# EAGLE schematic ES_Daisy_Patch_Rev4 (EAGLE 9.6.2)

## Sheet 1 of 4
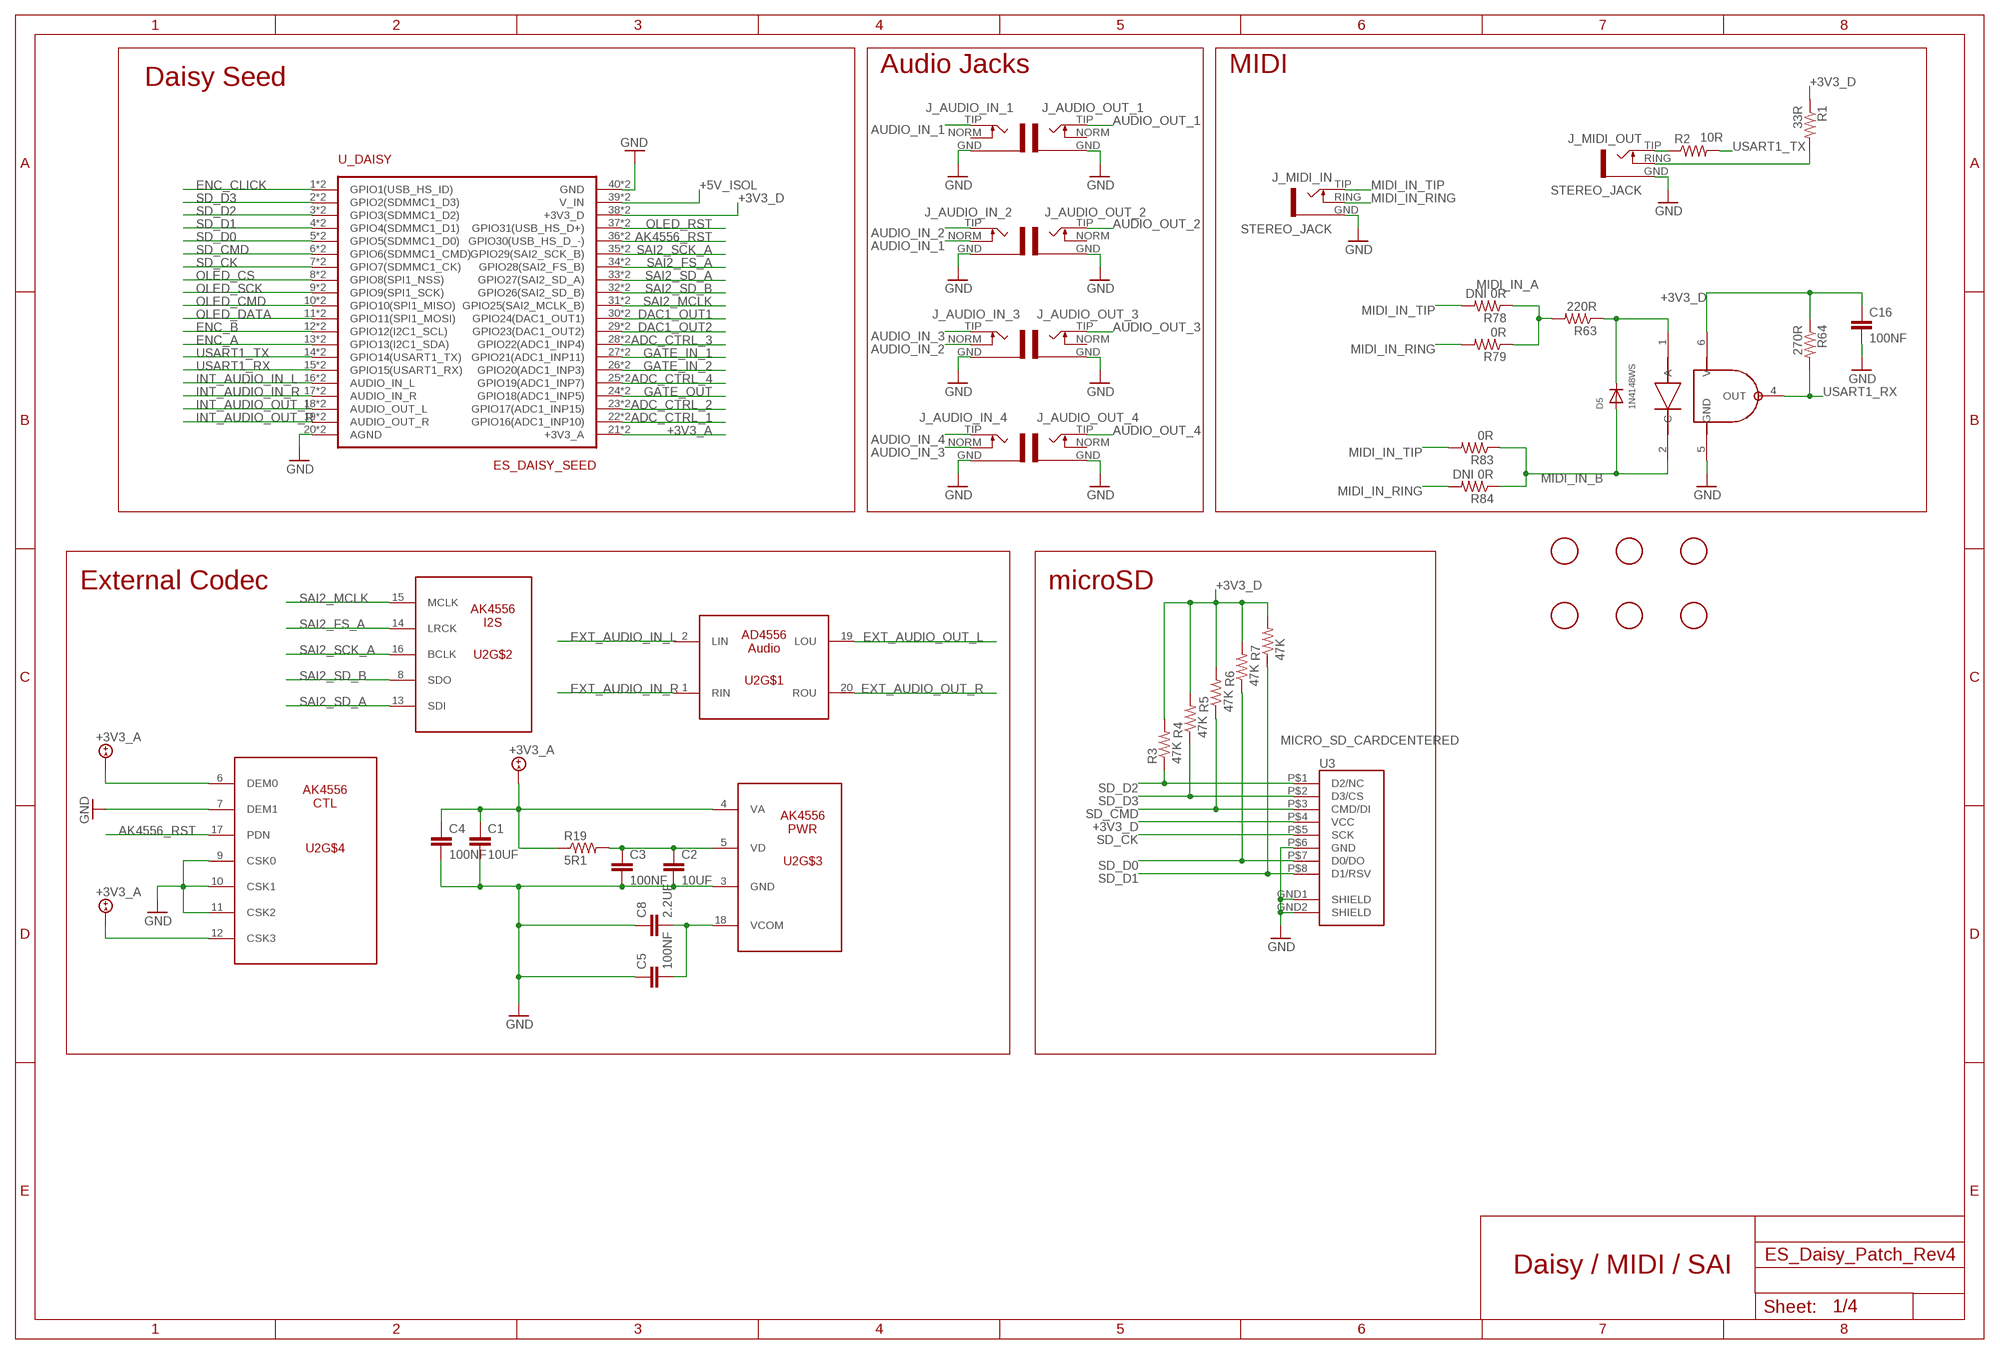
[diagram p0: schematic, sheet 1]

### Parts
C1  10UF  C-EUC0805  [C0805]
C2  10UF  C-EUC0805  [C0805]
C3  100NF  C-EUC0603  [C0603]
C4  100NF  C-EUC0603  [C0603]
C5  100NF  C-EUC0603  [C0603]
C8  2.2UF  C-EUC0603  [C0603]
C16  100NF  C-EUC0603  [C0603]
D5  1N4148WS  DIODE_SOD-323F  [SOD-323F]
FD1  FIDUCIAL  [FIDUCIAL_1MM]
FD2  FIDUCIAL  [FIDUCIAL_1MM]
FD3  FIDUCIAL  [FIDUCIAL_1MM]
FD4  FIDUCIAL  [FIDUCIAL_1MM]
FD5  FIDUCIAL  [FIDUCIAL_1MM]
FD6  FIDUCIAL  [FIDUCIAL_1MM]
J_AUDIO_IN_1  EURO_JACK  [S_JACK]
J_AUDIO_IN_2  EURO_JACK  [S_JACK]
J_AUDIO_IN_3  EURO_JACK  [S_JACK]
J_AUDIO_IN_4  EURO_JACK  [S_JACK]
J_AUDIO_OUT_1  EURO_JACK  [S_JACK]
J_AUDIO_OUT_2  EURO_JACK  [S_JACK]
J_AUDIO_OUT_3  EURO_JACK  [S_JACK]
J_AUDIO_OUT_4  EURO_JACK  [S_JACK]
J_MIDI_IN  STEREO_JACK  [STEREO_JACK_3.5MM]
J_MIDI_OUT  STEREO_JACK  [STEREO_JACK_3.5MM]
R1  33R  R-US_R0603  [R0603]
R2  10R  R-US_R0603  [R0603]
R3  47K  R-US_R0603  [R0603]
R4  47K  R-US_R0603  [R0603]
R5  47K  R-US_R0603  [R0603]
R6  47K  R-US_R0603  [R0603]
R7  47K  R-US_R0603  [R0603]
R19  5R1  R-US_R0603  [R0603]
R63  220R  R-US_R0603  [R0603]
R64  270R  R-US_R0603  [R0603]
R78  DNI 0R  R-US_R0603  [R0603]
R79  0R  R-US_R0603  [R0603]
R83  0R  R-US_R0603  [R0603]
R84  DNI 0R  R-US_R0603  [R0603]
U2  AK4556  [TSSOP20]
U3  MICRO_SD_CARDCENTERED  [VERT_MICROSD_CENTERED]
U15  OPTOISOLATOR_H11L1M  [DIL06_GULLWING]
U_DAISY  ES_DAISY_SEED  ES_DAISY_SEED_REV4_DOUBLE  [ES_DAISY_SEED_DOUBLE]

### Nets
+3V3_A: C1.1 C4.1 R19.1 U2.4(VA) U2.6(DEM0) U2.12(CSK3) U_DAISY.21(+3V3_A) U_DAISY.B21(+3V3_A) ; also sheet 2
+3V3_D: C16.1 R1.1 R3.2 R4.2 R5.2 R6.2 R7.2 R64.1 U3.P$4(VCC) U15.6(V) U_DAISY.38(+3V3_D) U_DAISY.B38(+3V3_D) ; also sheet 2,4
+5V_ISOL: U_DAISY.39(V_IN) U_DAISY.B39(V_IN) ; also sheet 4
ADC_CTRL_1: U_DAISY.22(GPIO16(ADC1_INP10)) U_DAISY.B22(GPIO16(ADC1_INP10)) ; also sheet 2
ADC_CTRL_2: U_DAISY.23(GPIO17(ADC1_INP15)) U_DAISY.B23(GPIO17(ADC1_INP15)) ; also sheet 2
ADC_CTRL_3: U_DAISY.28(GPIO22(ADC1_INP4)) U_DAISY.B28(GPIO22(ADC1_INP4)) ; also sheet 2
ADC_CTRL_4: U_DAISY.25(GPIO19(ADC1_INP7)) U_DAISY.B25(GPIO19(ADC1_INP7)) ; also sheet 2
AK4556_RST: U2.17(PDN) U_DAISY.36(GPIO30(USB_HS_D_-)) U_DAISY.B36(GPIO30(USB_HS_D_-))
AUDIO_IN_1: J_AUDIO_IN_1.TIP J_AUDIO_IN_2.NORM ; also sheet 3
AUDIO_IN_2: J_AUDIO_IN_2.TIP J_AUDIO_IN_3.NORM ; also sheet 3
AUDIO_IN_3: J_AUDIO_IN_3.TIP J_AUDIO_IN_4.NORM ; also sheet 3
AUDIO_IN_4: J_AUDIO_IN_4.TIP ; also sheet 3
AUDIO_OUT_1: J_AUDIO_OUT_1.TIP ; also sheet 3
AUDIO_OUT_2: J_AUDIO_OUT_2.TIP ; also sheet 3
AUDIO_OUT_3: J_AUDIO_OUT_3.TIP ; also sheet 3
AUDIO_OUT_4: J_AUDIO_OUT_4.TIP ; also sheet 3
DAC1_OUT1: U_DAISY.30(GPIO24(DAC1_OUT1)) U_DAISY.B30(GPIO24(DAC1_OUT1)) ; also sheet 2
DAC1_OUT2: U_DAISY.29(GPIO23(DAC1_OUT2)) U_DAISY.B29(GPIO23(DAC1_OUT2)) ; also sheet 2
ENC_A: U_DAISY.13(GPIO13(I2C1_SDA)) U_DAISY.B13(GPIO13(I2C1_SDA)) ; also sheet 4
ENC_B: U_DAISY.12(GPIO12(I2C1_SCL)) U_DAISY.B12(GPIO12(I2C1_SCL)) ; also sheet 4
ENC_CLICK: U_DAISY.1(GPIO1(USB_HS_ID)) U_DAISY.B1(GPIO1(USB_HS_ID)) ; also sheet 4
EXT_AUDIO_IN_L: U2.2(LIN) ; also sheet 3
EXT_AUDIO_IN_R: U2.1(RIN) ; also sheet 3
EXT_AUDIO_OUT_L: U2.19(LOU) ; also sheet 3
EXT_AUDIO_OUT_R: U2.20(ROU) ; also sheet 3
GATE_IN_1: U_DAISY.27(GPIO21(ADC1_INP11)) U_DAISY.B27(GPIO21(ADC1_INP11)) ; also sheet 2
GATE_IN_2: U_DAISY.26(GPIO20(ADC1_INP3)) U_DAISY.B26(GPIO20(ADC1_INP3)) ; also sheet 2
GATE_OUT: U_DAISY.24(GPIO18(ADC1_INP5)) U_DAISY.B24(GPIO18(ADC1_INP5)) ; also sheet 2
GND: C1.2 C2.2 C3.2 C4.2 C5.1 C8.1 C16.2 J_AUDIO_IN_1.GND J_AUDIO_IN_2.GND J_AUDIO_IN_3.GND J_AUDIO_IN_4.GND J_AUDIO_OUT_1.GND J_AUDIO_OUT_2.GND J_AUDIO_OUT_3.GND J_AUDIO_OUT_4.GND J_MIDI_IN.GND J_MIDI_OUT.GND U2.3(GND) U2.7(DEM1) U2.9(CSK0) U2.10(CSK1) U2.11(CSK2) U3.GND1(SHIELD) U3.GND2(SHIELD) U3.P$6(GND) U15.5(GND) U_DAISY.20(AGND) U_DAISY.40(GND) U_DAISY.B20(AGND) U_DAISY.B40(GND) ; also sheet 2,3,4
INT_AUDIO_IN_L: U_DAISY.16(AUDIO_IN_L) U_DAISY.B16(AUDIO_IN_L) ; also sheet 3
INT_AUDIO_IN_R: U_DAISY.17(AUDIO_IN_R) U_DAISY.B17(AUDIO_IN_R) ; also sheet 3
INT_AUDIO_OUT_L: U_DAISY.18(AUDIO_OUT_L) U_DAISY.B18(AUDIO_OUT_L) ; also sheet 3
INT_AUDIO_OUT_R: U_DAISY.19(AUDIO_OUT_R) U_DAISY.B19(AUDIO_OUT_R) ; also sheet 3
MIDI_IN_A: R63.2 R78.1 R79.1
MIDI_IN_B: D5.A R83.1 R84.1 U15.2(C)
MIDI_IN_RING: J_MIDI_IN.RING(NORM) R79.2 R84.2
MIDI_IN_TIP: J_MIDI_IN.TIP R78.2 R83.2
N$7: J_MIDI_OUT.TIP R2.1
N$9: J_MIDI_OUT.RING(NORM) R1.2
N$24: C2.1 C3.1 R19.2 U2.5(VD)
N$25: C5.2 C8.2 U2.18(VCOM)
N$77: D5.C R63.1 U15.1(A)
OLED_CMD: U_DAISY.10(GPIO10(SPI1_MISO)) U_DAISY.B10(GPIO10(SPI1_MISO)) ; also sheet 4
OLED_CS: U_DAISY.8(GPIO8(SPI1_NSS)) U_DAISY.B8(GPIO8(SPI1_NSS)) ; also sheet 4
OLED_DATA: U_DAISY.11(GPIO11(SPI1_MOSI)) U_DAISY.B11(GPIO11(SPI1_MOSI)) ; also sheet 4
OLED_RST: U_DAISY.37(GPIO31(USB_HS_D+)) U_DAISY.B37(GPIO31(USB_HS_D+)) ; also sheet 4
OLED_SCK: U_DAISY.9(GPIO9(SPI1_SCK)) U_DAISY.B9(GPIO9(SPI1_SCK)) ; also sheet 4
SAI2_FS_A: U2.14(LRCK) U_DAISY.34(GPIO28(SAI2_FS_B)) U_DAISY.B34(GPIO28(SAI2_FS_B))
SAI2_MCLK: U2.15(MCLK) U_DAISY.31(GPIO25(SAI2_MCLK_B)) U_DAISY.B31(GPIO25(SAI2_MCLK_B))
SAI2_SCK_A: U2.16(BCLK) U_DAISY.35(GPIO29(SAI2_SCK_B)) U_DAISY.B35(GPIO29(SAI2_SCK_B))
SAI2_SD_A: U2.13(SDI) U_DAISY.33(GPIO27(SAI2_SD_A)) U_DAISY.B33(GPIO27(SAI2_SD_A))
SAI2_SD_B: U2.8(SDO) U_DAISY.32(GPIO26(SAI2_SD_B)) U_DAISY.B32(GPIO26(SAI2_SD_B))
SD_CK: U3.P$5(SCK) U_DAISY.7(GPIO7(SDMMC1_CK)) U_DAISY.B7(GPIO7(SDMMC1_CK))
SD_CMD: R5.1 U3.P$3(CMD/DI) U_DAISY.6(GPIO6(SDMMC1_CMD)) U_DAISY.B6(GPIO6(SDMMC1_CMD))
SD_D0: R6.1 U3.P$7(D0/DO) U_DAISY.5(GPIO5(SDMMC1_D0)) U_DAISY.B5(GPIO5(SDMMC1_D0))
SD_D1: R7.1 U3.P$8(D1/RSV) U_DAISY.4(GPIO4(SDMMC1_D1)) U_DAISY.B4(GPIO4(SDMMC1_D1))
SD_D2: R3.1 U3.P$1(D2/NC) U_DAISY.3(GPIO3(SDMMC1_D2)) U_DAISY.B3(GPIO3(SDMMC1_D2))
SD_D3: R4.1 U3.P$2(D3/CS) U_DAISY.2(GPIO2(SDMMC1_D3)) U_DAISY.B2(GPIO2(SDMMC1_D3))
USART1_RX: R64.2 U15.4(OUT) U_DAISY.15(GPIO15(USART1_RX)) U_DAISY.B15(GPIO15(USART1_RX))
USART1_TX: R2.2 U_DAISY.14(GPIO14(USART1_TX)) U_DAISY.B14(GPIO14(USART1_TX))
Unconnected: J_AUDIO_IN_1.NORM J_AUDIO_OUT_1.NORM J_AUDIO_OUT_2.NORM J_AUDIO_OUT_3.NORM J_AUDIO_OUT_4.NORM

### Notes on the sheet
- Audio Jacks | MIDI
- Daisy Seed
- External Codec | microSD
- Daisy / MIDI / SAI

## Sheet 2 of 4
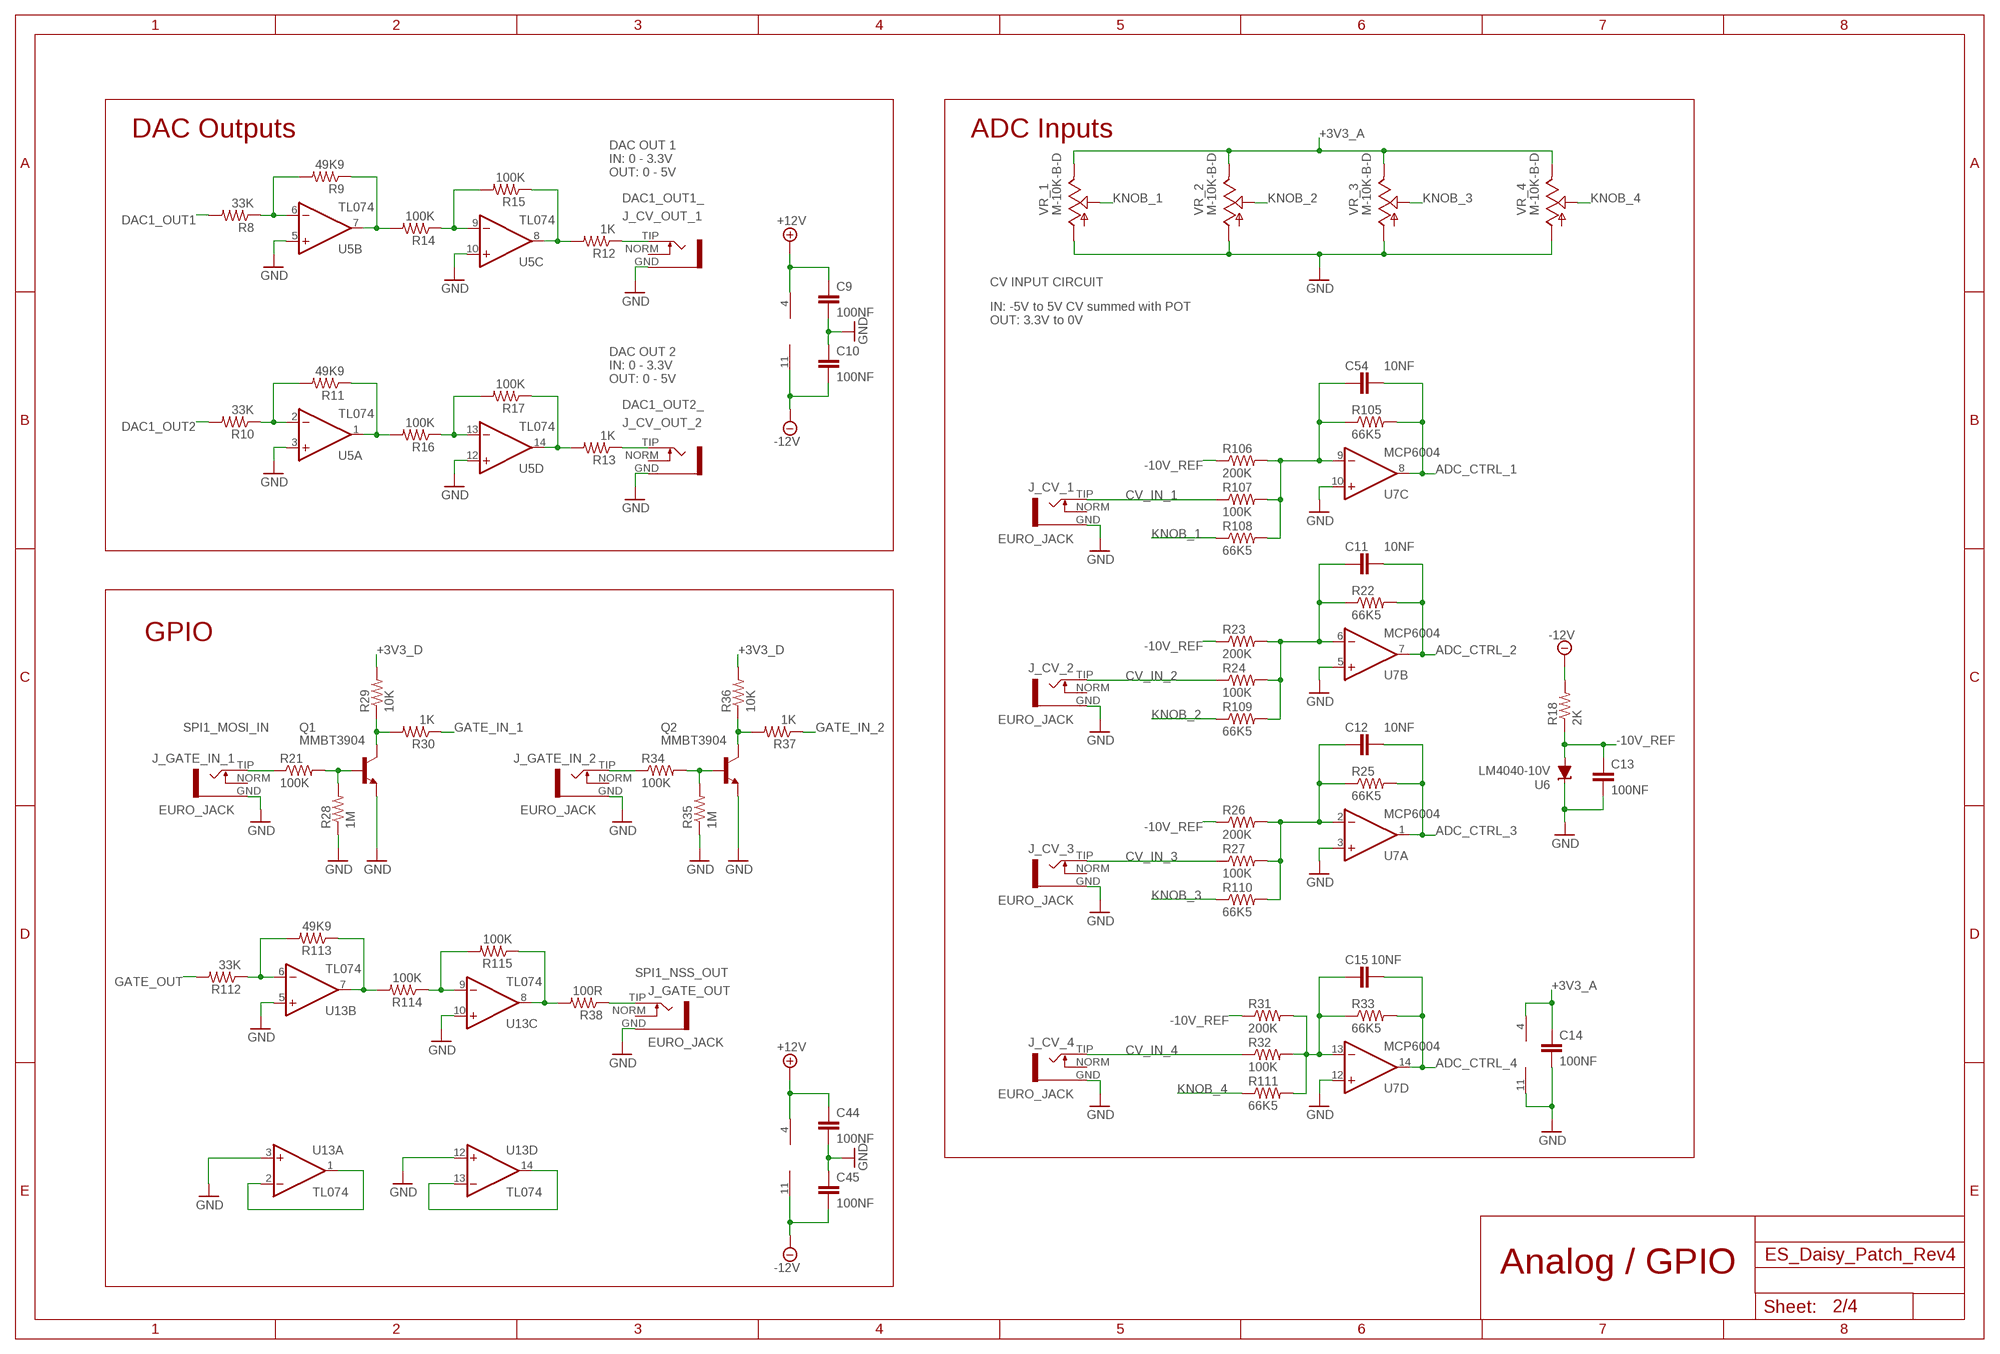
[diagram p1: schematic, sheet 2]

### Parts
C9  100NF  C-EUC0603  [C0603]
C10  100NF  C-EUC0603  [C0603]
C11  10NF  C-EUC0603  [C0603]
C12  10NF  C-EUC0603  [C0603]
C13  100NF  C-EUC0603  [C0603]
C14  100NF  C-EUC0603  [C0603]
C15  10NF  C-EUC0603  [C0603]
C44  100NF  C-EUC0603  [C0603]
C45  100NF  C-EUC0603  [C0603]
C54  10NF  C-EUC0603  [C0603]
J_CV_1  EURO_JACK  [S_JACK]
J_CV_2  EURO_JACK  [S_JACK]
J_CV_3  EURO_JACK  [S_JACK]
J_CV_4  EURO_JACK  [S_JACK]
J_CV_OUT_1  EURO_JACK  [S_JACK]
J_CV_OUT_2  EURO_JACK  [S_JACK]
J_GATE_IN_1  EURO_JACK  [S_JACK]
J_GATE_IN_2  EURO_JACK  [S_JACK]
J_GATE_OUT  EURO_JACK  [S_JACK]
Q1  MMBT3904  NPNSOT23-BEC  [SOT23-BEC]
Q2  MMBT3904  NPNSOT23-BEC  [SOT23-BEC]
R8  33K  R-US_R0603  [R0603]
R9  49K9  R-US_R0603  [R0603]
R10  33K  R-US_R0603  [R0603]
R11  49K9  R-US_R0603  [R0603]
R12  1K  R-US_R0603  [R0603]
R13  1K  R-US_R0603  [R0603]
R14  100K  R-US_R0603  [R0603]
R15  100K  R-US_R0603  [R0603]
R16  100K  R-US_R0603  [R0603]
R17  100K  R-US_R0603  [R0603]
R18  2K  R-US_R0603  [R0603]
R21  100K  R-US_R0603  [R0603]
R22  66K5  R-US_R0603  [R0603]
R23  200K  R-US_R0603  [R0603]
R24  100K  R-US_R0603  [R0603]
R25  66K5  R-US_R0603  [R0603]
R26  200K  R-US_R0603  [R0603]
R27  100K  R-US_R0603  [R0603]
R28  1M  R-US_R0603  [R0603]
R29  10K  R-US_R0603  [R0603]
R30  1K  R-US_R0603  [R0603]
R31  200K  R-US_R0603  [R0603]
R32  100K  R-US_R0603  [R0603]
R33  66K5  R-US_R0603  [R0603]
R34  100K  R-US_R0603  [R0603]
R35  1M  R-US_R0603  [R0603]
R36  10K  R-US_R0603  [R0603]
R37  1K  R-US_R0603  [R0603]
R38  100R  R-US_R0603  [R0603]
R105  66K5  R-US_R0603  [R0603]
R106  200K  R-US_R0603  [R0603]
R107  100K  R-US_R0603  [R0603]
R108  66K5  R-US_R0603  [R0603]
R109  66K5  R-US_R0603  [R0603]
R110  66K5  R-US_R0603  [R0603]
R111  66K5  R-US_R0603  [R0603]
R112  33K  R-US_R0603  [R0603]
R113  49K9  R-US_R0603  [R0603]
R114  100K  R-US_R0603  [R0603]
R115  100K  R-US_R0603  [R0603]
U5  TL074  TL074_TSSOP-14  [TSSOP-14]
U6  LM4040-10V  LM4040-10VA12DBZ  [DBZ_R-PDSO-G3]
U7  MCP6004  MCP6004_TSSOP-14  [TSSOP-14]
U13  TL074  TL074_TSSOP-14  [TSSOP-14]
VR_1  M-10K-B-D  POT_9MM_SNAP-IN__  [9MM_SNAP-IN_POT_SILK]
VR_2  M-10K-B-D  POT_9MM_SNAP-IN__  [9MM_SNAP-IN_POT_SILK]
VR_3  M-10K-B-D  POT_9MM_SNAP-IN__  [9MM_SNAP-IN_POT_SILK]
VR_4  M-10K-B-D  POT_9MM_SNAP-IN__  [9MM_SNAP-IN_POT_SILK]

### Nets
+3V3_A: C14.1 U7.4(P:V+) VR_1.3 VR_2.3 VR_3.3 VR_4.3 ; also sheet 1
+3V3_D: R29.2 R36.2 ; also sheet 1,4
+12V: C9.1 C44.1 U5.4(P:V+) U13.4(P:V+) ; also sheet 3,4
-10V_REF: C13.1 R18.1 R23.1 R26.1 R31.1 R106.1 U6.2(A)
-12V: C10.2 C45.2 R18.2 U5.11(P:V-) U13.11(P:V-) ; also sheet 3,4
ADC_CTRL_1: C54.2 R105.2 U7.8(C:OUT) ; also sheet 1
ADC_CTRL_2: C11.2 R22.2 U7.7(B:OUT) ; also sheet 1
ADC_CTRL_3: C12.2 R25.2 U7.1(A:OUT) ; also sheet 1
ADC_CTRL_4: C15.2 R33.2 U7.14(D:OUT) ; also sheet 1
CV_IN_1: J_CV_1.TIP R107.1
CV_IN_2: J_CV_2.TIP R24.1
CV_IN_3: J_CV_3.TIP R27.1
CV_IN_4: J_CV_4.TIP R32.1
DAC1_OUT1: R8.2 ; also sheet 1
DAC1_OUT1_: J_CV_OUT_1.TIP R12.1
DAC1_OUT2: R10.2 ; also sheet 1
DAC1_OUT2_: J_CV_OUT_2.TIP R13.1
GATE_IN_1: R30.1 ; also sheet 1
GATE_IN_2: R37.1 ; also sheet 1
GATE_OUT: R112.2 ; also sheet 1
GND: C9.2 C10.1 C13.2 C14.2 C44.2 C45.1 J_CV_1.GND J_CV_2.GND J_CV_3.GND J_CV_4.GND J_CV_OUT_1.GND J_CV_OUT_2.GND J_GATE_IN_1.GND J_GATE_IN_2.GND J_GATE_OUT.GND Q1.E Q2.E R28.1 R35.1 U5.3(A:+IN) U5.5(B:+IN) U5.10(C:+IN) U5.12(D:+IN) U6.1(C) U7.3(A:+IN) U7.5(B:+IN) U7.10(C:+IN) U7.11(P:V-) U7.12(D:+IN) U13.3(A:+IN) U13.5(B:+IN) U13.10(C:+IN) U13.12(D:+IN) VR_1.1 VR_2.1 VR_3.1 VR_4.1 ; also sheet 1,3,4
KNOB_1: R108.1 VR_1.2
KNOB_2: R109.1 VR_2.2
KNOB_3: R110.1 VR_3.2
KNOB_4: R111.1 VR_4.2
N$1: R14.1 R15.2 U5.9(C:-IN)
N$10: R12.2 R15.1 U5.8(C:OUT)
N$11: R8.1 R9.2 U5.6(B:-IN)
N$12: R9.1 R14.2 U5.7(B:OUT)
N$13: C54.1 R105.1 R106.2 R107.2 R108.2 U7.9(C:-IN)
N$14: R10.1 R11.2 U5.2(A:-IN)
N$15: R11.1 R16.2 U5.1(A:OUT)
N$16: R112.1 R113.2 U13.6(B:-IN)
N$17: R16.1 R17.2 U5.13(D:-IN)
N$18: R13.2 R17.1 U5.14(D:OUT)
N$19: U13.1(A:OUT) U13.2(A:-IN)
N$20: R113.1 R114.2 U13.7(B:OUT)
N$21: R114.1 R115.2 U13.9(C:-IN)
N$22: R38.2 R115.1 U13.8(C:OUT)
N$23: Q1.C R29.1 R30.2
N$27: C11.1 R22.1 R23.2 R24.2 R109.2 U7.6(B:-IN)
N$30: Q2.B R34.2 R35.2
N$31: C12.1 R25.1 R26.2 R27.2 R110.2 U7.2(A:-IN)
N$32: Q1.B R21.2 R28.2
N$33: Q2.C R36.1 R37.2
N$39: C15.1 R31.2 R32.2 R33.1 R111.2 U7.13(D:-IN)
N$59: U13.13(D:-IN) U13.14(D:OUT)
SPI1_MISO_IN: J_GATE_IN_2.TIP R34.1
SPI1_MOSI_IN: J_GATE_IN_1.TIP R21.1
SPI1_NSS_OUT: J_GATE_OUT.TIP R38.1
Unconnected: J_CV_1.NORM J_CV_2.NORM J_CV_3.NORM J_CV_4.NORM J_CV_OUT_1.NORM J_CV_OUT_2.NORM J_GATE_IN_1.NORM J_GATE_IN_2.NORM J_GATE_OUT.NORM

### Notes on the sheet
- DAC Outputs | ADC Inputs
- DAC OUT 1
  IN: 0 - 3.3V
  OUT: 0 - 5V
- CV INPUT CIRCUIT
- IN: -5V to 5V CV summed with POT
  OUT: 3.3V to 0V
- DAC OUT 2
  IN: 0 - 3.3V
  OUT: 0 - 5V
- GPIO
- Analog / GPIO

## Sheet 3 of 4
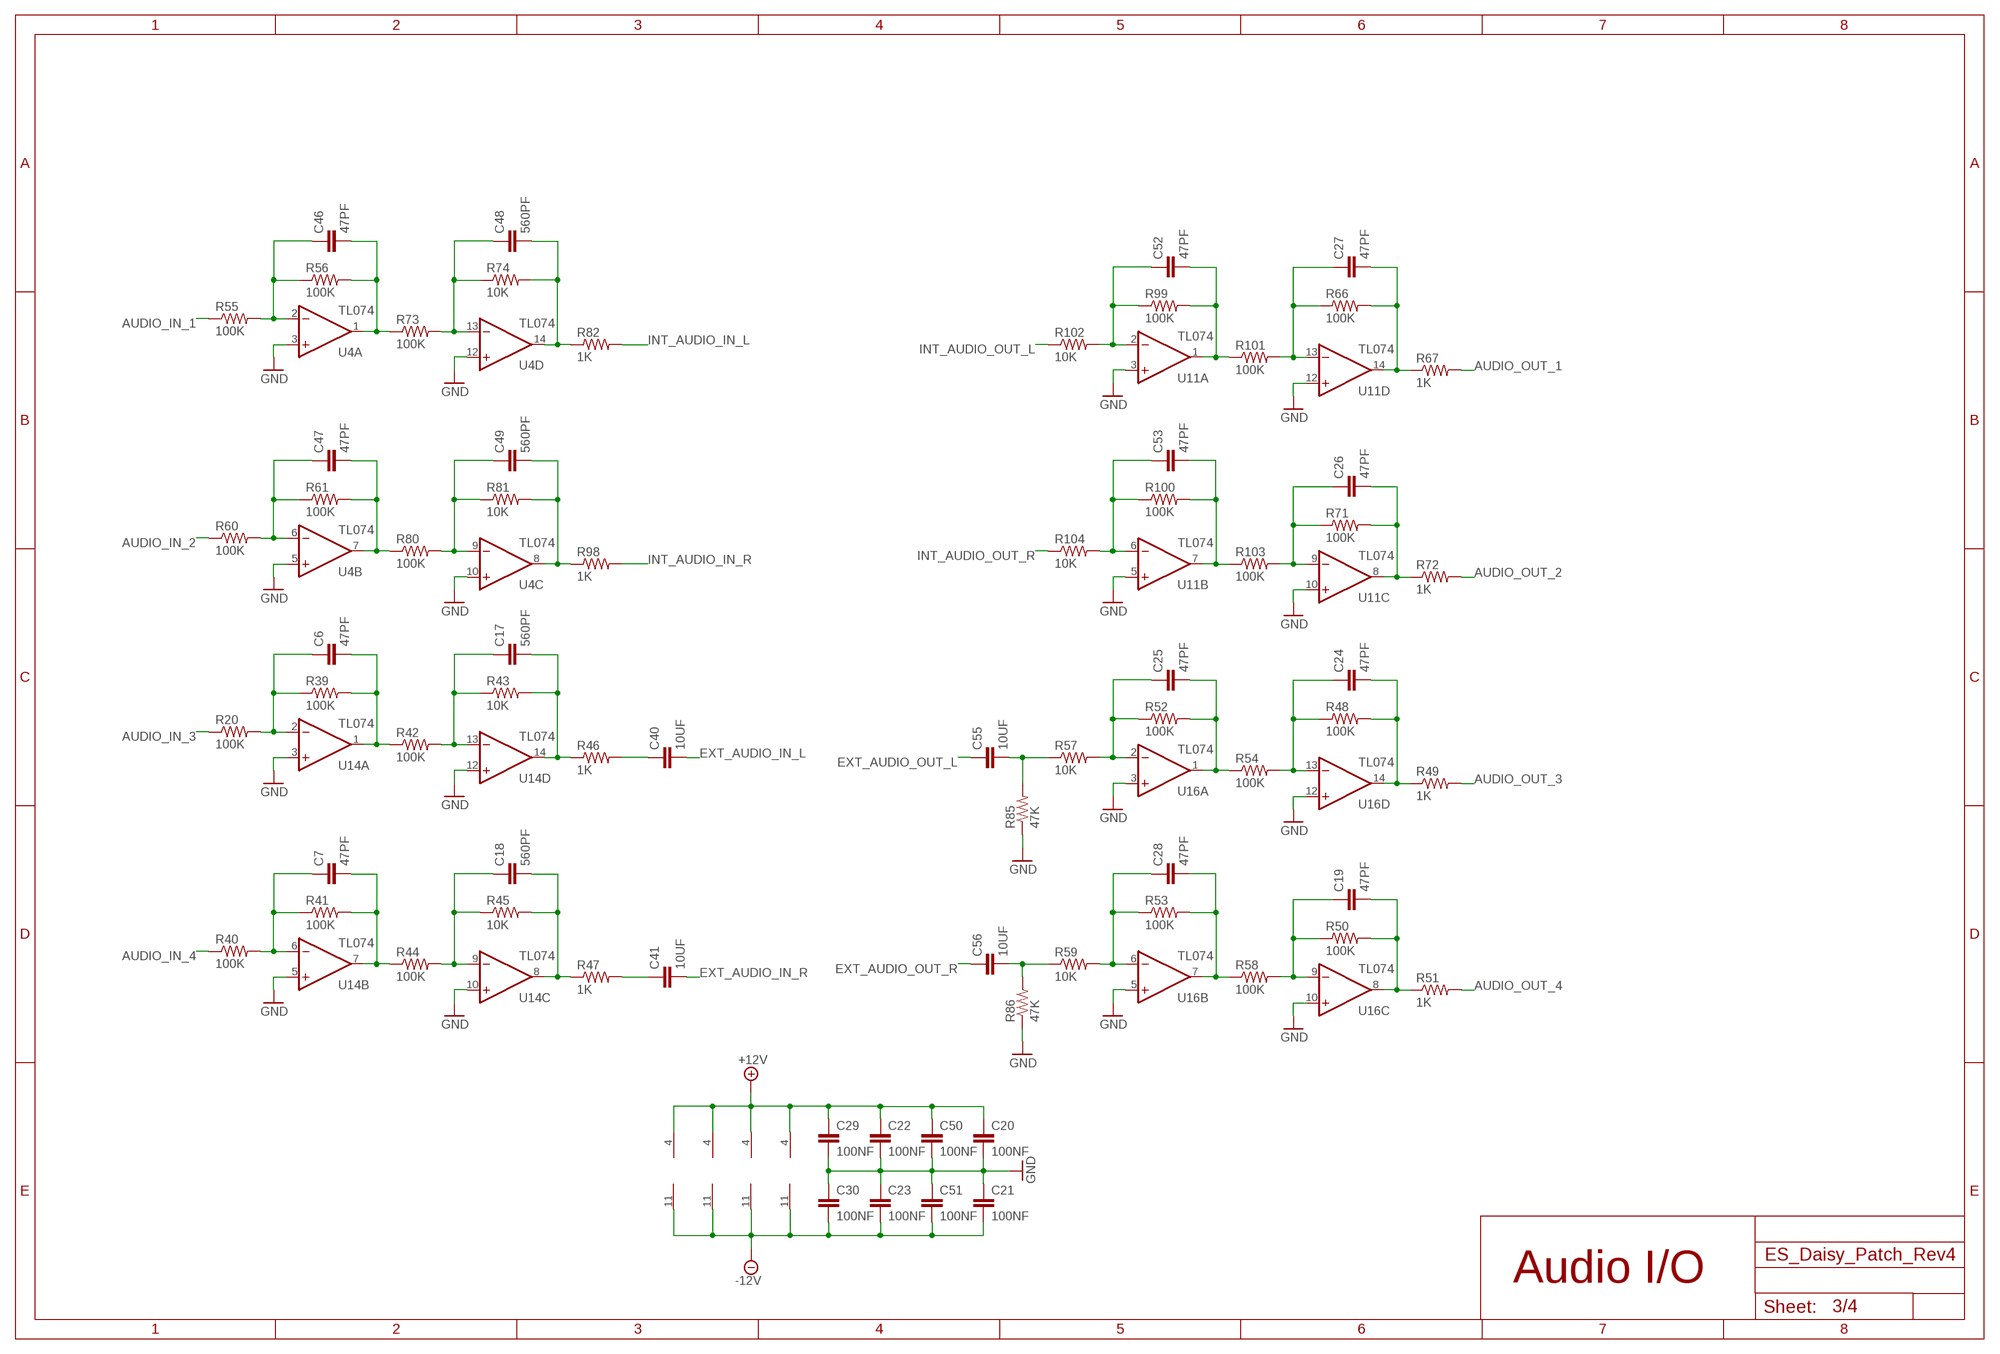
[diagram p2: schematic, sheet 3]

### Parts
C6  47PF  C-EUC0603  [C0603]
C7  47PF  C-EUC0603  [C0603]
C17  560PF  C-EUC0603  [C0603]
C18  560PF  C-EUC0603  [C0603]
C19  47PF  C-EUC0603  [C0603]
C20  100NF  C-EUC0603  [C0603]
C21  100NF  C-EUC0603  [C0603]
C22  100NF  C-EUC0603  [C0603]
C23  100NF  C-EUC0603  [C0603]
C24  47PF  C-EUC0603  [C0603]
C25  47PF  C-EUC0603  [C0603]
C26  47PF  C-EUC0603  [C0603]
C27  47PF  C-EUC0603  [C0603]
C28  47PF  C-EUC0603  [C0603]
C29  100NF  C-EUC0603  [C0603]
C30  100NF  C-EUC0603  [C0603]
C40  10UF  C-EUC0805  [C0805]
C41  10UF  C-EUC0805  [C0805]
C46  47PF  C-EUC0603  [C0603]
C47  47PF  C-EUC0603  [C0603]
C48  560PF  C-EUC0603  [C0603]
C49  560PF  C-EUC0603  [C0603]
C50  100NF  C-EUC0603  [C0603]
C51  100NF  C-EUC0603  [C0603]
C52  47PF  C-EUC0603  [C0603]
C53  47PF  C-EUC0603  [C0603]
C55  10UF  C-EUC0805  [C0805]
C56  10UF  C-EUC0805  [C0805]
R20  100K  R-US_R0603  [R0603]
R39  100K  R-US_R0603  [R0603]
R40  100K  R-US_R0603  [R0603]
R41  100K  R-US_R0603  [R0603]
R42  100K  R-US_R0603  [R0603]
R43  10K  R-US_R0603  [R0603]
R44  100K  R-US_R0603  [R0603]
R45  10K  R-US_R0603  [R0603]
R46  1K  R-US_R0603  [R0603]
R47  1K  R-US_R0603  [R0603]
R48  100K  R-US_R0603  [R0603]
R49  1K  R-US_R0603  [R0603]
R50  100K  R-US_R0603  [R0603]
R51  1K  R-US_R0603  [R0603]
R52  100K  R-US_R0603  [R0603]
R53  100K  R-US_R0603  [R0603]
R54  100K  R-US_R0603  [R0603]
R55  100K  R-US_R0603  [R0603]
R56  100K  R-US_R0603  [R0603]
R57  10K  R-US_R0603  [R0603]
R58  100K  R-US_R0603  [R0603]
R59  10K  R-US_R0603  [R0603]
R60  100K  R-US_R0603  [R0603]
R61  100K  R-US_R0603  [R0603]
R66  100K  R-US_R0603  [R0603]
R67  1K  R-US_R0603  [R0603]
R71  100K  R-US_R0603  [R0603]
R72  1K  R-US_R0603  [R0603]
R73  100K  R-US_R0603  [R0603]
R74  10K  R-US_R0603  [R0603]
R80  100K  R-US_R0603  [R0603]
R81  10K  R-US_R0603  [R0603]
R82  1K  R-US_R0603  [R0603]
R85  47K  R-US_R0603  [R0603]
R86  47K  R-US_R0603  [R0603]
R98  1K  R-US_R0603  [R0603]
R99  100K  R-US_R0603  [R0603]
R100  100K  R-US_R0603  [R0603]
R101  100K  R-US_R0603  [R0603]
R102  10K  R-US_R0603  [R0603]
R103  100K  R-US_R0603  [R0603]
R104  10K  R-US_R0603  [R0603]
U4  TL074  TL074_TSSOP-14  [TSSOP-14]
U11  TL074  TL074_TSSOP-14  [TSSOP-14]
U14  TL074  TL074_TSSOP-14  [TSSOP-14]
U16  TL074  TL074_TSSOP-14  [TSSOP-14]

### Nets
+12V: C20.1 C22.1 C29.1 C50.1 U4.4(P:V+) U11.4(P:V+) U14.4(P:V+) U16.4(P:V+) ; also sheet 2,4
-12V: C21.2 C23.2 C30.2 C51.2 U4.11(P:V-) U11.11(P:V-) U14.11(P:V-) U16.11(P:V-) ; also sheet 2,4
AUDIO_IN_1: R55.1 ; also sheet 1
AUDIO_IN_2: R60.1 ; also sheet 1
AUDIO_IN_3: R20.1 ; also sheet 1
AUDIO_IN_4: R40.1 ; also sheet 1
AUDIO_OUT_1: R67.2 ; also sheet 1
AUDIO_OUT_2: R72.2 ; also sheet 1
AUDIO_OUT_3: R49.2 ; also sheet 1
AUDIO_OUT_4: R51.2 ; also sheet 1
EXT_AUDIO_IN_L: C40.2 ; also sheet 1
EXT_AUDIO_IN_R: C41.2 ; also sheet 1
EXT_AUDIO_OUT_L: C55.1 ; also sheet 1
EXT_AUDIO_OUT_R: C56.1 ; also sheet 1
GND: C20.2 C21.1 C22.2 C23.1 C29.2 C30.1 C50.2 C51.1 R85.1 R86.1 U4.3(A:+IN) U4.5(B:+IN) U4.10(C:+IN) U4.12(D:+IN) U11.3(A:+IN) U11.5(B:+IN) U11.10(C:+IN) U11.12(D:+IN) U14.3(A:+IN) U14.5(B:+IN) U14.10(C:+IN) U14.12(D:+IN) U16.3(A:+IN) U16.5(B:+IN) U16.10(C:+IN) U16.12(D:+IN) ; also sheet 1,2,4
INT_AUDIO_IN_L: R82.2 ; also sheet 1
INT_AUDIO_IN_R: R98.2 ; also sheet 1
INT_AUDIO_OUT_L: R102.1 ; also sheet 1
INT_AUDIO_OUT_R: R104.1 ; also sheet 1
N$2: C40.1 R46.2
N$3: C7.1 R40.2 R41.1 U14.6(B:-IN)
N$4: C7.2 R41.2 R44.1 U14.7(B:OUT)
N$5: C48.1 R73.2 R74.1 U4.13(D:-IN)
N$6: C6.1 R20.2 R39.1 U14.2(A:-IN)
N$8: C6.2 R39.2 R42.1 U14.1(A:OUT)
N$26: C17.1 R42.2 R43.1 U14.13(D:-IN)
N$28: C18.1 R44.2 R45.1 U14.9(C:-IN)
N$29: C18.2 R45.2 R47.1 U14.8(C:OUT)
N$34: C17.2 R43.2 R46.1 U14.14(D:OUT)
N$35: C19.1 R50.1 R58.2 U16.9(C:-IN)
N$36: C19.2 R50.2 R51.1 U16.8(C:OUT)
N$37: C24.1 R48.1 R54.2 U16.13(D:-IN)
N$38: C24.2 R48.2 R49.1 U16.14(D:OUT)
N$40: C25.1 R52.1 R57.2 U16.2(A:-IN)
N$41: C25.2 R52.2 R54.1 U16.1(A:OUT)
N$42: C28.1 R53.1 R59.2 U16.6(B:-IN)
N$43: C28.2 R53.2 R58.1 U16.7(B:OUT)
N$48: C41.1 R47.2
N$51: C55.2 R57.1 R85.2
N$53: C56.2 R59.1 R86.2
N$67: C46.1 R55.2 R56.1 U4.2(A:-IN)
N$69: C46.2 R56.2 R73.1 U4.1(A:OUT)
N$70: C47.1 R60.2 R61.1 U4.6(B:-IN)
N$71: C47.2 R61.2 R80.1 U4.7(B:OUT)
N$80: C27.1 R66.1 R101.2 U11.13(D:-IN)
N$82: C27.2 R66.2 R67.1 U11.14(D:OUT)
N$85: C49.1 R80.2 R81.1 U4.9(C:-IN)
N$86: C26.1 R71.1 R103.2 U11.9(C:-IN)
N$88: C26.2 R71.2 R72.1 U11.8(C:OUT)
N$100: C49.2 R81.2 R98.1 U4.8(C:OUT)
N$101: C48.2 R74.2 R82.1 U4.14(D:OUT)
N$105: C52.1 R99.1 R102.2 U11.2(A:-IN)
N$106: C52.2 R99.2 R101.1 U11.1(A:OUT)
N$108: C53.1 R100.1 R104.2 U11.6(B:-IN)
N$110: C53.2 R100.2 R103.1 U11.7(B:OUT)

### Notes on the sheet
- Audio I/O

## Sheet 4 of 4
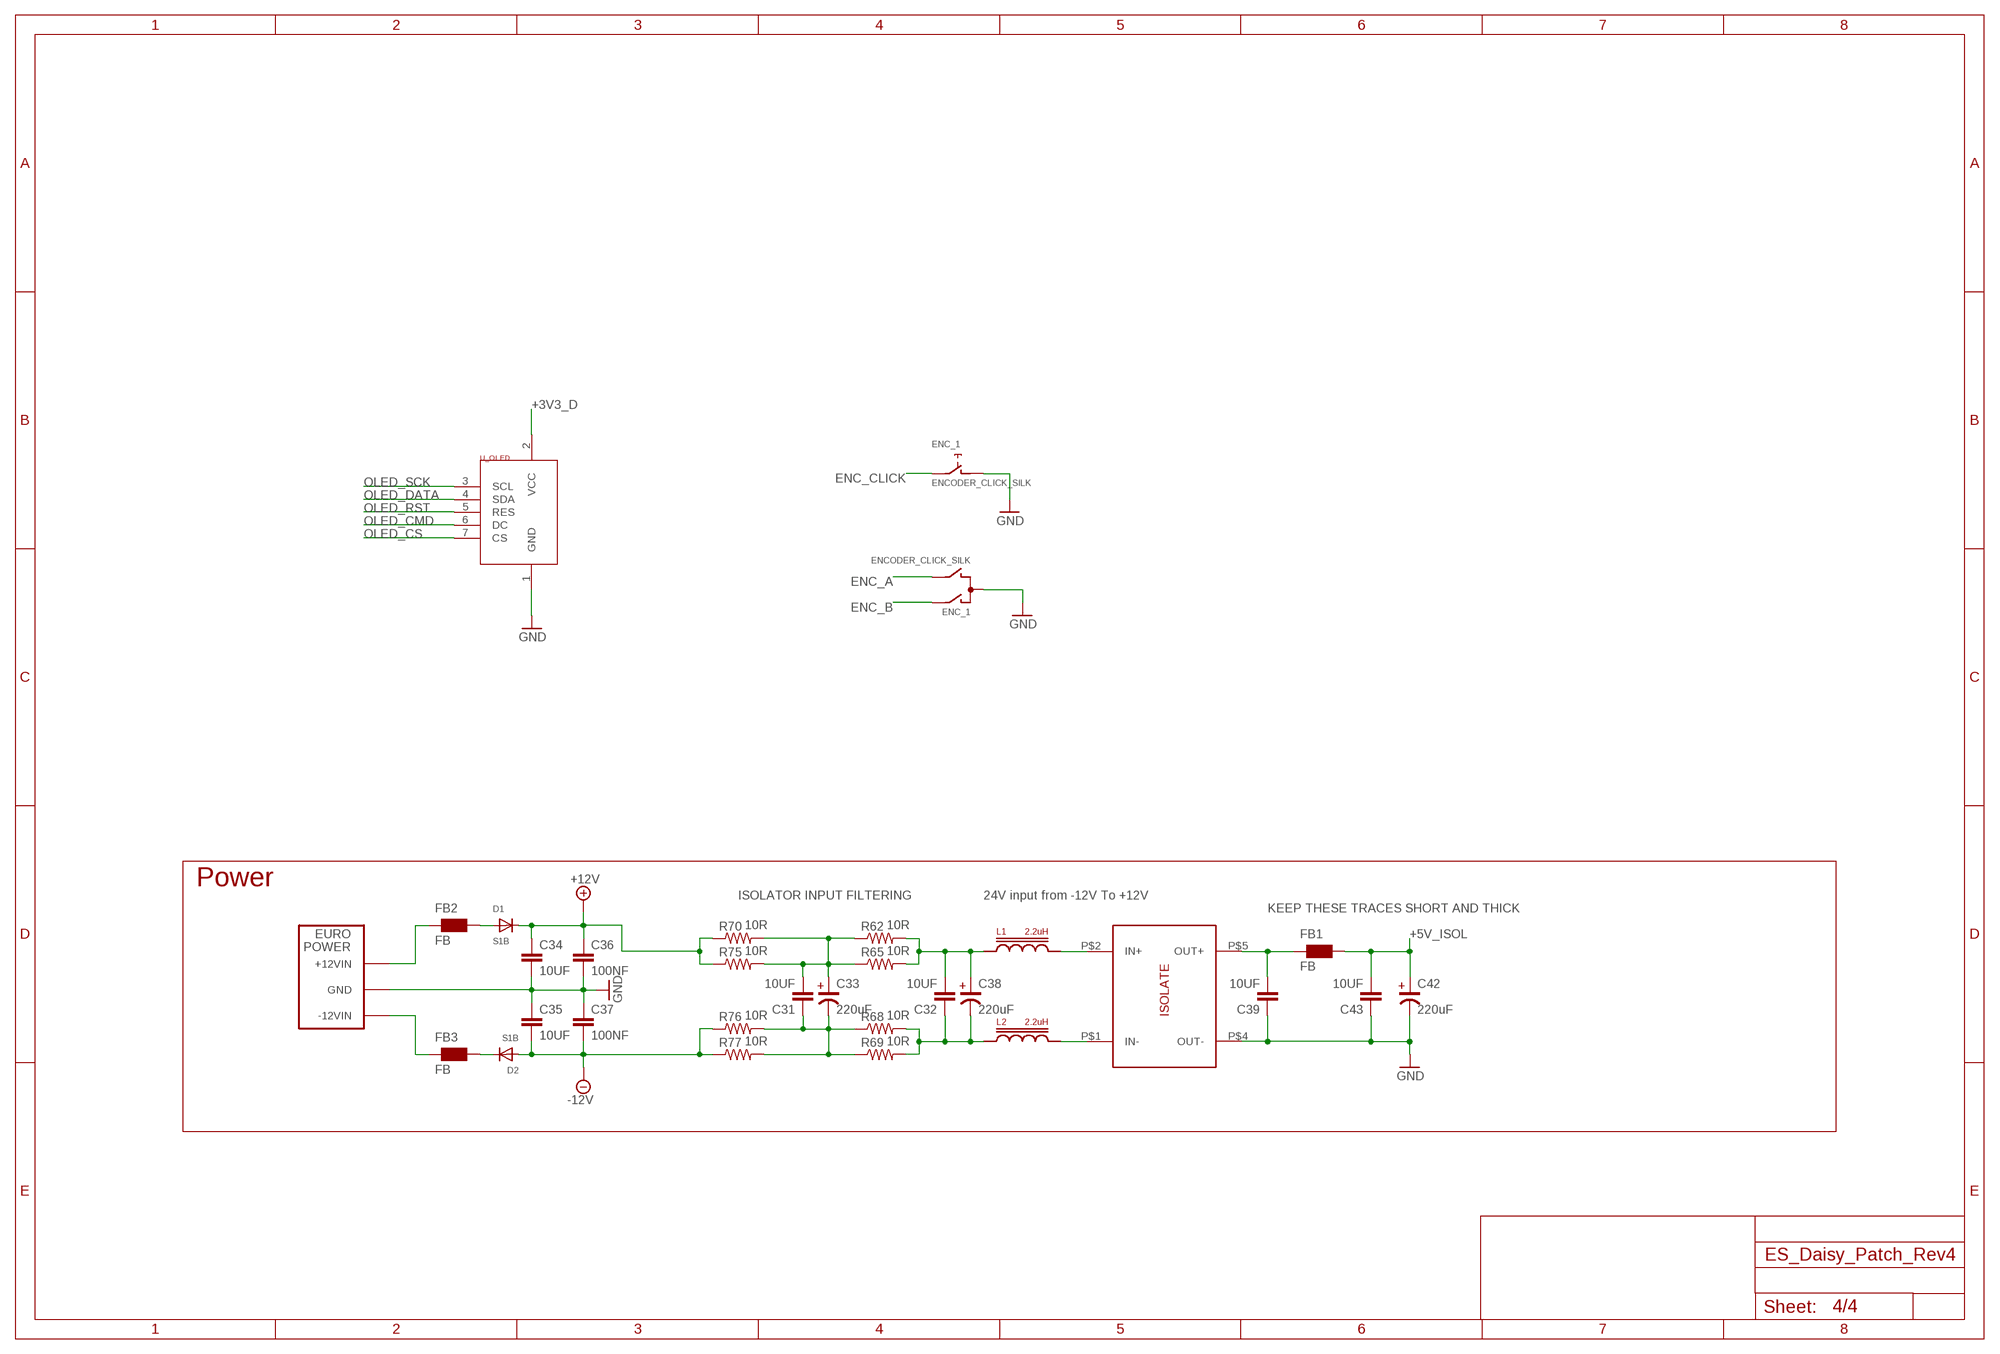
[diagram p3: schematic, sheet 4]

### Parts
C31  10UF  C-EUC0805  [C0805]
C32  10UF  C-EUC0805  [C0805]
C33  220uF  C-EU-POL_D  [PANASONIC_D]
C34  10UF  C-EUC0805  [C0805]
C35  10UF  C-EUC0805  [C0805]
C36  100NF  C-EUC0603  [C0603]
C37  100NF  C-EUC0603  [C0603]
C38  220uF  C-EU-POL_D  [PANASONIC_D]
C39  10UF  C-EUC0805  [C0805]
C42  220uF  C-EU-POL_D  [PANASONIC_D]
C43  10UF  C-EUC0805  [C0805]
D1  S1B  [SMADIODE]
D2  S1B  [SMADIODE]
ENC_1  ENCODER_CLICK_SILK  [PEC11_SILK]
EP1  EURORACK_POWERSMT  [EURORACK_POWER_SMT]
FB1  FB  FERRITE_BEAD_0603  [WUERTH-ELEKTRONIK_0603]
FB2  FB  FERRITE_BEAD_0603  [WUERTH-ELEKTRONIK_0603]
FB3  FB  FERRITE_BEAD_0603  [WUERTH-ELEKTRONIK_0603]
L1  2.2uH  INDUCTORS  [BOURNS_SRP2010]
L2  2.2uH  INDUCTORS  [BOURNS_SRP2010]
R62  10R  R-US_R0603  [R0603]
R65  10R  R-US_R0603  [R0603]
R68  10R  R-US_R0603  [R0603]
R69  10R  R-US_R0603  [R0603]
R70  10R  R-US_R0603  [R0603]
R75  10R  R-US_R0603  [R0603]
R76  10R  R-US_R0603  [R0603]
R77  10R  R-US_R0603  [R0603]
U$1  POWER_ISOLATE  [XP_POWER_ISEXXXXA]
U_OLED  OLED_DISPLAY  [ER-OLEDM015-2]

### Nets
+3V3_D: U_OLED.2(VCC) ; also sheet 1,2
+5V_ISOL: C42.+(POS) C43.2 FB1.2 ; also sheet 1
+12V: C34.1 C36.1 D1.C R70.1 R75.1 ; also sheet 2,3
-12V: C35.2 C37.2 D2.A R76.1 R77.1 ; also sheet 2,3
ENC_A: ENC_1.B ; also sheet 1
ENC_B: ENC_1.A ; also sheet 1
ENC_CLICK: ENC_1.E ; also sheet 1
GND: C34.2 C35.1 C36.2 C37.1 C39.1 C42.-(NEG) C43.1 ENC_1.C ENC_1.D EP1.GND1A(GND) EP1.GND1B(GND) EP1.GND2A(GND) EP1.GND2B(GND) EP1.GND3A(GND) EP1.GND3B(GND) U$1.P$4(OUT-) U_OLED.1(GND) ; also sheet 1,2,3
N$44: C39.2 FB1.1 U$1.P$5(OUT+)
N$45: L1.P$2 U$1.P$2(IN+)
N$46: L2.P$2 U$1.P$1(IN-)
N$47: C32.2 C38.+(POS) L1.P$1 R62.2 R65.2
N$49: C31.2 C33.+(POS) R62.1 R65.1 R70.2 R75.2
N$50: C31.1 C33.-(NEG) R68.1 R69.1 R76.2 R77.2
N$52: C32.1 C38.-(NEG) L2.P$1 R68.2 R69.2
N$75: EP1.P12VA(+12VIN) EP1.P12VB(+12VIN) FB2.1
N$78: EP1.N12VA(-12VIN) EP1.N12VB(-12VIN) FB3.1
N$84: D1.A FB2.2
N$89: D2.C FB3.2
OLED_CMD: U_OLED.6(DC) ; also sheet 1
OLED_CS: U_OLED.7(CS) ; also sheet 1
OLED_DATA: U_OLED.4(SDA) ; also sheet 1
OLED_RST: U_OLED.5(RES) ; also sheet 1
OLED_SCK: U_OLED.3(SCL) ; also sheet 1
Unconnected: ENC_1.GND1(G) ENC_1.GND2(G)

### Notes on the sheet
- Power
- ISOLATOR INPUT FILTERING | 24V input from -12V To +12V
- KEEP THESE TRACES SHORT AND THICK

## Library data of the parts
C1 C2 C31 C32 C34 C35 C39-C41 C43 C55 C56 = Electrosmith-Passives:C-EU: CAPACITOR, European symbol; PACKAGE: C0805
C3-C30 C36 C37 C44-C54 = Electrosmith-Passives:C-EU: CAPACITOR, European symbol; PACKAGE: C0603
C33 C38 C42 = Electrosmith-Passives:C-EU-POL
D1 D2 = Electrosmith-Semiconductors:S1B; BIN#: 12-006; IPN: S1B; MPN: S1B; PACKAGE: SMA
D5 = Electrosmith-Semiconductors:DIODE: Diode SMADIODE - SMA Surface Mount Package 20V 1A Schottky Diode Digikey: 641-1014-6-ND DO-1N4148 - Through Hole Small Current Diode SOD-123 20V 1 A (.5mV Vf) Schottky Diode - Digikey: MBRX120TPMSCT-ND SOD-323 10V 570mA (.38mV Vf, 3ns) Schottky Diode - Digikey: ZLLS410CT-ND SOD-523 30V 30mA Schottky Diode (RB751S-40TE61) - Digikey: RB751S-40TE61CT-ND SOT23-R/W - SOT23 Package (R = Solder Paste/Reflow Ovens, W = Hand-Soldering) BAT54Film 40V 300mA - Digikey: 497-7162-1-ND; PACKAGE: SOD-323
ENC_1 = Electrosmith-Interface:ENCODER: ALPS rotary Encoder EC12E series with switch
EP1 = Electrosmith-Connectors:EURORACK_POWER; MANF: FCI; MPN: 54202-G08-05
FB1-FB3 = Electrosmith-Passives:FERRITE_BEAD: SMD EMI Suppression Ferrite Beads - excellent anti-EMI properties - low DCR - impedances till 3000 ohms - rated current up to 6 A; BIN#: 8-047; IPN: FB R0603; MPN: MI0603J601R-10; PACKAGE: R0603
FD1-FD6 = Electrosmith-Connectors:FIDUCIAL: For use by pick and place machines to calibrate the vision/machine, 1mm By microbuilder.eu
J_AUDIO_IN_1-J_AUDIO_IN_4 J_AUDIO_OUT_1-J_AUDIO_OUT_4 J_CV_1-J_CV_4 J_CV_OUT_1 J_CV_OUT_2 J_GATE_IN_1 J_GATE_IN_2 J_GATE_OUT = Electrosmith-Interface:EURO_JACK
J_MIDI_IN J_MIDI_OUT = Electrosmith-Interface:STEREO_JACK
L1 L2 = Electrosmith-Passives:INDUCTOR
Q1 Q2 = Electrosmith-Semiconductors:NPN: NPN Transistror BF959 corrected 2008.03.06
R1-R86 R98-R115 = Electrosmith-Passives:R-US_: RESISTOR, American symbol; PACKAGE: R0603
U2 = Electrosmith-IC:AK4556
U3 = Electrosmith-Interface:MICRO_SD_CARD
U4 U5 U11 U13 U14 U16 = Electrosmith-IC:TL074: OP AMP; BIN#: 12-011; IPN: TL074 TSSOP-14; MPN: TL074CPWR; PACKAGE: TSSOP-14
U6 = Electrosmith-Power:LM4040-10V: PRECISION MICROPOWER SHUNT VOLTAGE REFERENCE Source: http://focus.ti.com/lit/ds/slcs146e/slcs146e.pdf; IPN: LM4040-10V; MPN: LM4041A12IDBZR; OC_FARNELL: 1407949; OC_NEWARK: 58K5875; PACKAGE: SOT-23
U7 = Electrosmith-IC:MCP6004; BIN#: N/A; IPN: MCP6004 TSSOP-14; MPN: MCP6004T-E/ST; PACKAGE: TSSOP-14
U15 = Electrosmith-IC:OPTOISOLATOR_H11L1M; MPN: H11L1SR2M
U$1 = Electrosmith-IC:POWER_ISOLATE; MPN: ISE2405A
U_DAISY = Electrosmith-Boards:ES_DAISY_SEED_REV4
U_OLED = Electrosmith-Interface:OLED_DISPLAY; IPN: 1.5" Display Module PTH; MPN: ER-OLEDM015-2W-SPI-I2C
VR_1-VR_4 = Electrosmith-Interface:POT_9MM_SNAP-IN_: 9mm vertical snap-in pot, Alpha / Panasonic style

## Net classes
0 default: width 0.203 mm
1 POWER: width 0.102 mm, clearance 0.102 mm
9 AGND: clearance 0.102 mm